# Altium schematic sheet FSM.SchDoc
size A4
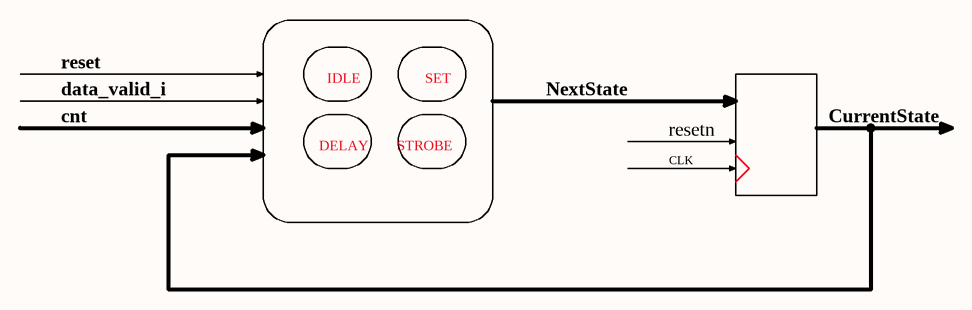
[diagram p0: FSM.SchDoc]

## Notes on the sheet
- data_valid_i
- cnt
- reset
- IDLE
- SET
- NextState
- CurrentState
- DELAY
- STROBE
- resetn
- CLK